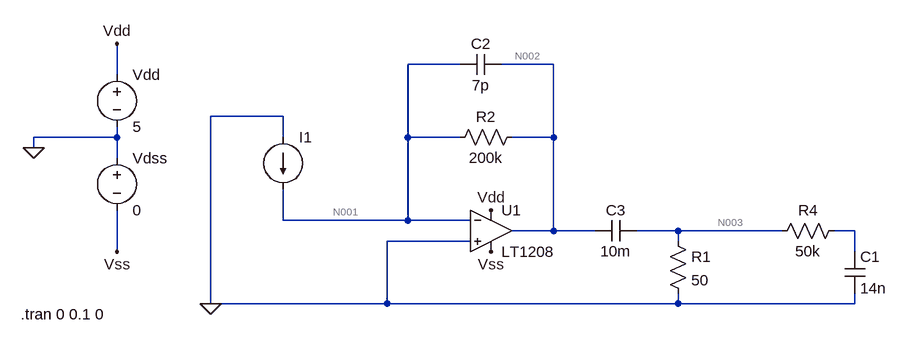
[diagram p0: schematic transimpedance_amplifier.asc]
transimpedance_amplifier.asc, the LTspice schematic file:
Version 4
SHEET 1 1288 680
WIRE 576 64 496 64
WIRE 720 64 640 64
WIRE 48 80 48 32
WIRE 304 144 192 144
WIRE 48 176 48 160
WIRE 48 176 -80 176
WIRE 304 176 304 144
WIRE 496 176 496 64
WIRE 576 176 496 176
WIRE 720 176 720 64
WIRE 720 176 656 176
WIRE -80 192 -80 176
WIRE 48 208 48 176
WIRE 304 304 304 256
WIRE 496 304 496 176
WIRE 496 304 304 304
WIRE 592 304 496 304
WIRE 720 320 720 176
WIRE 720 320 656 320
WIRE 784 320 720 320
WIRE 912 320 848 320
WIRE 1072 320 912 320
WIRE 1184 320 1152 320
WIRE 592 336 464 336
WIRE 912 336 912 320
WIRE 48 352 48 288
WIRE 1184 352 1184 320
WIRE 192 432 192 144
WIRE 464 432 464 336
WIRE 464 432 192 432
WIRE 912 432 912 416
WIRE 912 432 464 432
WIRE 1184 432 1184 416
WIRE 1184 432 912 432
FLAG -80 192 0
FLAG 48 32 Vdd
FLAG 48 352 Vss
FLAG 624 288 Vdd
FLAG 624 352 Vss
FLAG 192 432 0
SYMBOL current 304 176 R0
WINDOW 3 24 80 Invisible 2
WINDOW 123 0 0 Left 2
WINDOW 39 0 0 Left 2
SYMATTR InstName I1
SYMATTR Value SINE(0 0.000000075 100)
SYMBOL Opamps\\LT1208 624 256 R0
SYMATTR InstName U1
SYMBOL voltage 48 192 R0
WINDOW 123 0 0 Left 2
WINDOW 39 0 0 Left 2
SYMATTR InstName Vdss
SYMATTR Value 0
SYMBOL voltage 48 64 R0
WINDOW 123 0 0 Left 2
WINDOW 39 0 0 Left 2
SYMATTR InstName Vdd
SYMATTR Value 5
SYMBOL res 672 160 R90
WINDOW 0 0 56 VBottom 2
WINDOW 3 32 56 VTop 2
SYMATTR InstName R2
SYMATTR Value 200k
SYMBOL cap 640 48 R90
WINDOW 0 0 32 VBottom 2
WINDOW 3 32 32 VTop 2
SYMATTR InstName C2
SYMATTR Value 7p
SYMBOL cap 848 304 R90
WINDOW 0 0 32 VBottom 2
WINDOW 3 32 32 VTop 2
SYMATTR InstName C3
SYMATTR Value 10m
SYMBOL res 1168 304 R90
WINDOW 0 0 56 VBottom 2
WINDOW 3 32 56 VTop 2
SYMATTR InstName R4
SYMATTR Value 50k
SYMBOL cap 1168 352 R0
SYMATTR InstName C1
SYMATTR Value 14n
SYMBOL res 896 320 R0
SYMATTR InstName R1
SYMATTR Value 50
TEXT -100 448 Left 2 !.tran 0 0.1 0

The netlist it stands for:
* transimpedance_amplifier.asc
I1 0 N001 SINE(0 0.000000075 100)
XU1 0 N001 Vdd Vss N002 LT1208  ; pins In+ In- V+ V- OUT
Vdss 0 Vss 0
Vdd Vdd 0 5
R2 N002 N001 200k
C2 N002 N001 7p
C3 N003 N002 10m
R4 N004 N003 50k
C1 N004 0 14n
R1 N003 0 50
.tran 0 0.1 0
.backanno
.end

* Results of the author's LTspice run, read from the files saved beside the schematic
* Operating Point, zero values left out:
*   V(n001) = 1.756 V
*   V(vdd) = 5 V
*   V(n002) = 3.957 V
*   I(R2) = 11 µA
*   I(Vdd) = -7.001 mA
*   I(Vdss) = -6.994 mA
*   Ix(u1:1) = -7.086 µA
*   Ix(u1:2) = 11 µA
*   Ix(u1:3) = 7.001 mA
*   Ix(u1:4) = -6.994 mA
*   Ix(u1:5) = -11 µA
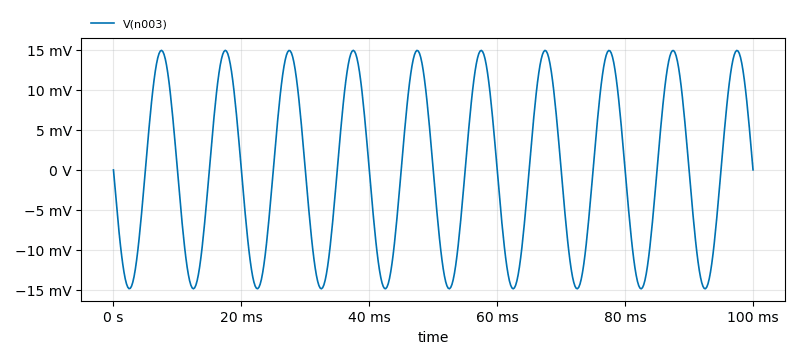
[diagram p1: Transient Analysis of transimpedance_amplifier.asc, plotted from the saved traces]
* Transient Analysis, 1 run:
*   V(n003): min -14.86 mV, max 14.95 mV, average 42.84 µV, rms 10.54 mV, last 6.361 µV